# EAGLE design Truss-Power-V4 (EAGLE 8.4.3)

## Sheet 1 of 2
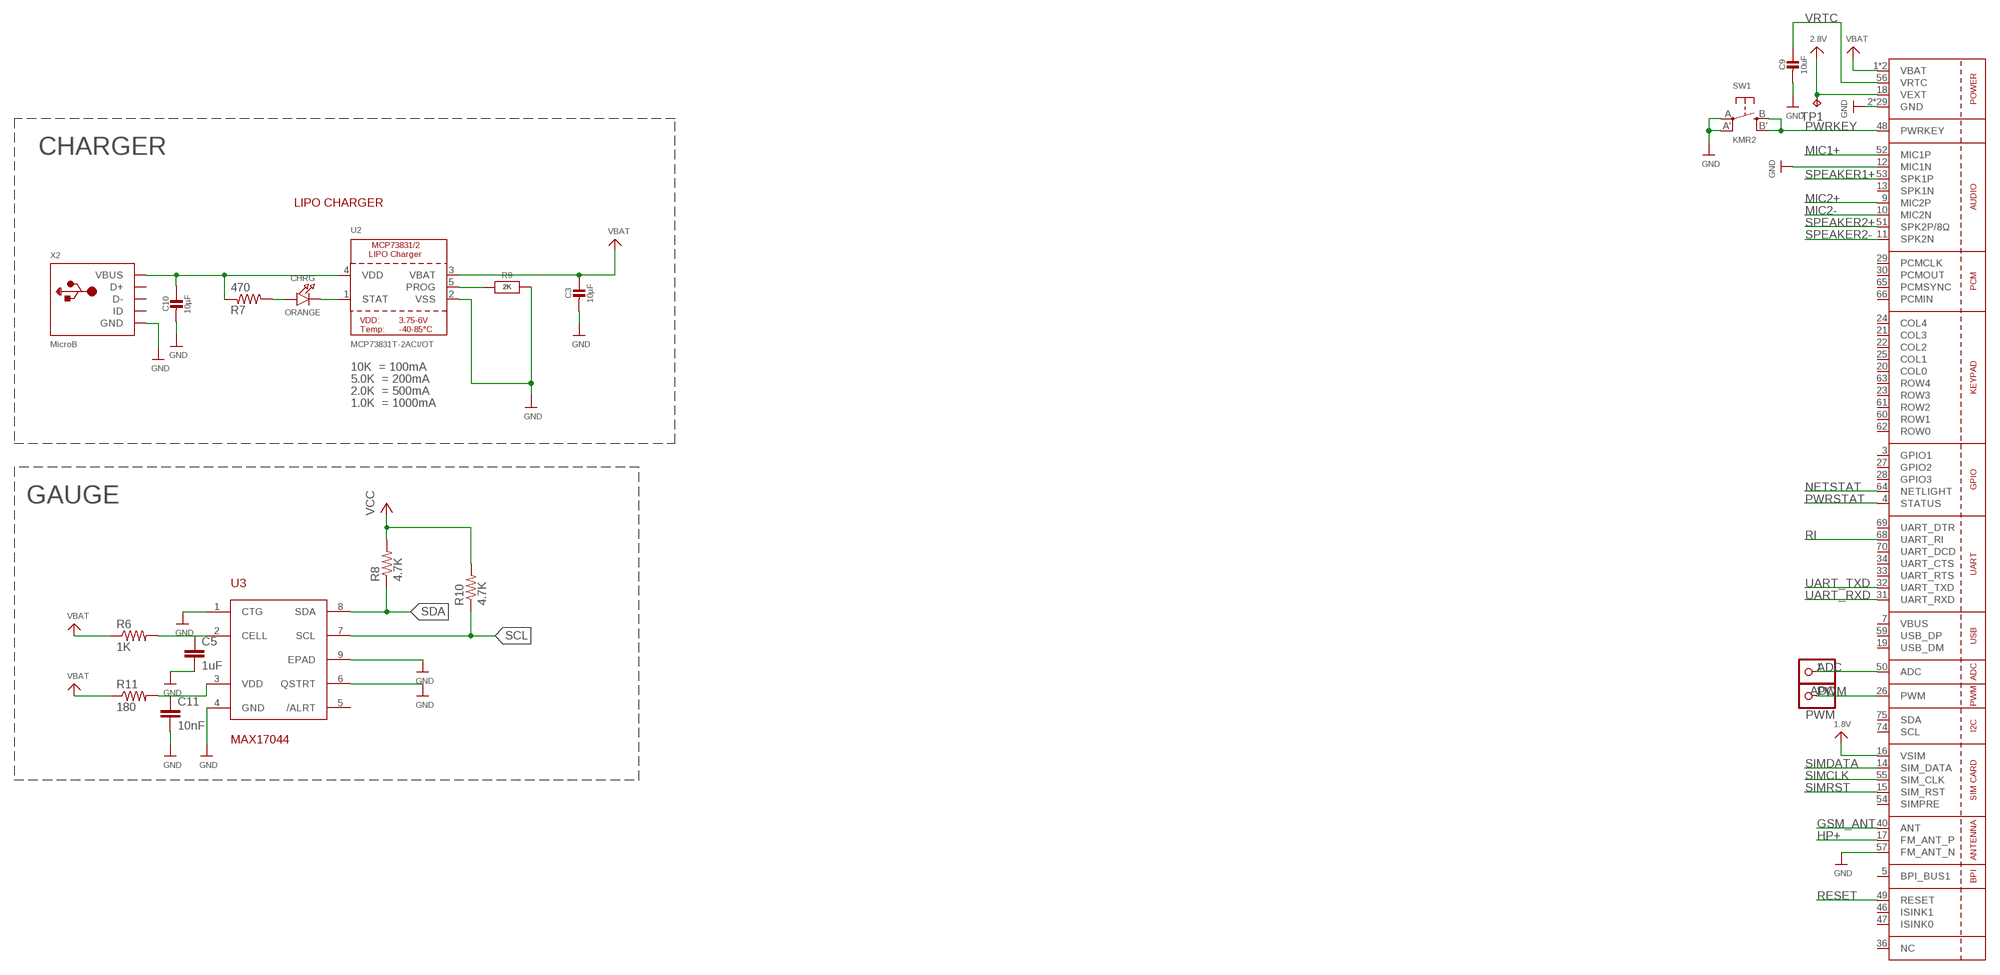
[diagram p0: schematic, sheet 1]

### Parts
ADC  PINHD-1X1CB  [1X01-CLEANBIG]
C3  10µF  CAP_CERAMIC0805-NOOUTLINE  [0805-NO]
C5  1uF  C-EUC0603  [C0603]
C9  10uF  CAP_CERAMIC0805-NOOUTLINE  [0805-NO]
C10  10µF  CAP_CERAMIC0805-NOOUTLINE  [0805-NO]
C11  10nF  C-EUC0603  [C0603]
CHRG  ORANGE  LED0805_NOOUTLINE  [CHIPLED_0805_NOOUTLINE]
PWM  PINHD-1X1CB  [1X01-CLEANBIG]
R6  1K  R-US_R0402  [R0402]
R7  470  R-US_R0402  [R0402]
R8  4.7K  R-US_R0402  [R0402]
R9  2K  RESISTOR0805_NOOUTLINE  [0805-NO]
R10  4.7K  R-US_R0402  [R0402]
R11  180  R-US_R0402  [R0402]
SW1  KMR2  SWITCH_TACT_SMT4.6X2.8  [BTN_KMR2_4.6X2.8]
TP1  TPTP11R  [TP11R]
U2  MCP73831T-2ACI/OT  MCP73831/2  [SOT23-5]
U3  MAX17044  [TDFN]
U4  SIM800H/L  GSM_SIM800L  [SIM800L]
X2  MicroB  USBMICRO_20329  [4UCONN_20329]

### Nets
1.8V: U4.16(VSIM)
2.8V: TP1.TP U4.18(VEXT)
ADC: ADC.1 U4.50(ADC)
GND: C3.2 C5.2 C9.2 C10.2 C11.2 R9.2 SW1.A'(P1) SW1.A(P) U2.2(VSS) U3.1(CTG) U3.4(GND) U3.6(QSTRT) U3.9(EPAD) U4.2(GND) U4.6(GND) U4.8(GND) U4.12(MIC1N) U4.35(GND) U4.37(GND) U4.38(GND) U4.39(GND) U4.41(GND) U4.43(GND) U4.44(GND) U4.45(GND) U4.57(FM_ANT_N) U4.58(GND) U4.67(GND) U4.71(GND) U4.72(GND) U4.73(GND) U4.76(GND) U4.77(GND) U4.78(GND) U4.79(GND) U4.80(GND) U4.81(GND) U4.82(GND) U4.83(GND) U4.84(GND) U4.85(GND) U4.86(GND) U4.87(GND) U4.88(GND) X2.BASE@1(GND) X2.BASE@2(GND) X2.GND X2.SPRT@1(GND) X2.SPRT@2(GND) X2.SPRT@3(GND) X2.SPRT@4(GND) ; also sheet 2
GSM_ANT: U4.40(ANT)
HP+: U4.17(FM_ANT_P)
MIC1+: U4.52(MIC1P)
MIC2+: U4.9(MIC2P)
MIC2-: U4.10(MIC2N)
N$1: C5.1 R6.2 U3.2(CELL)
N$3: C11.1 R11.2 U3.3(VDD)
N$6: CHRG.A R7.2
N$7: CHRG.C U2.1(STAT)
N$14: R9.1 U2.5(PROG)
NETSTAT: U4.64(NETLIGHT)
PWM: PWM.1 U4.26(PWM)
PWRKEY: SW1.B'(S1) SW1.B(S) U4.48(PWRKEY)
PWRSTAT: U4.4(STATUS)
RESET: U4.49(RESET)
RI: U4.68(UART_RI)
SCL: R10.1 U3.7(SCL) ; also sheet 2
SDA: R8.1 U3.8(SDA) ; also sheet 2
SIMCLK: U4.55(SIM_CLK)
SIMDATA: U4.14(SIM_DATA)
SIMRST: U4.15(SIM_RST)
SPEAKER1+: U4.53(SPK1P)
SPEAKER2+: U4.51(SPK2P/8Ω)
SPEAKER2-: U4.11(SPK2N)
UART_RXD: U4.31(UART_RXD)
UART_TXD: U4.32(UART_TXD)
VBAT: C3.1 R6.1 R8.2 R10.2 R11.1 U2.3(VBAT) U4.1(VBAT) U4.42(VBAT) ; supply symbol labelled VCC ; also sheet 2
VBUS: C10.1 R7.1 U2.4(VDD) X2.VBUS
VRTC: C9.1 U4.56(VRTC)
Unconnected: U3.5(/ALRT) U4.3(GPIO1) U4.5(BPI_BUS1) U4.13(SPK1N) U4.19(USB_DM) U4.20(COL0) U4.21(COL3) U4.22(COL2) U4.23(ROW3) U4.24(COL4) U4.25(COL1) U4.27(GPIO2) U4.28(GPIO3) U4.29(PCMCLK) U4.30(PCMOUT) U4.33(UART_RTS) U4.34(UART_CTS) U4.36(NC) U4.46(ISINK1) U4.47(ISINK0) U4.54(SIMPRE) U4.59(USB_DP) U4.60(ROW1) U4.61(ROW2) U4.62(ROW0) U4.63(ROW4) U4.65(PCMSYNC) U4.66(PCMIN) U4.69(UART_DTR) U4.70(UART_DCD) U4.74(SCL) U4.75(SDA) X2.D+ X2.D- X2.ID

### Notes on the sheet
- CHARGER
- LIPO CHARGER
- 10K  = 100mA
- 5.0K  = 200mA
- 2.0K  = 500mA
- 1.0K  = 1000mA
- GAUGE

## Sheet 2 of 2
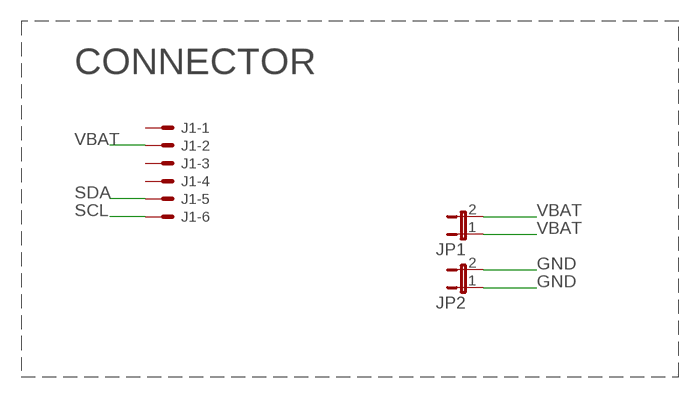
[diagram p1: schematic, sheet 2]

### Parts
J1  XF2L-0625-1  [XF2L-0625-1]
JP1  JP1E  [JP1]
JP2  JP1E  [JP1]

### Nets
GND: JP2.1 JP2.2 ; also sheet 1
SCL: J1.6 ; also sheet 1
SDA: J1.5 ; also sheet 1
VBAT: J1.2 JP1.1 JP1.2 ; also sheet 1
Unconnected: J1.1 J1.3 J1.4

### Notes on the sheet
- CONNECTOR

## Power pins joined to a net without a drawn wire
VBUS: U4.7(VBUS)

## Library data of the parts
ADC PWM = adafruit:PINHD-1X1: Pin header 1x1 for 0.1" spacing With round pins
C3 C9 C10 = microbuilder:CAP_CERAMIC: Ceramic Capacitors For new designs, use the packages preceded by an '_' character since they are more reliable: The following footprints should be used on most boards: _0402 - Standard footprint for regular board layouts _0603 - Standard footprint for regular board layouts _0805 - Standard footprint for regular board layouts _1206 - Standard footprint for regular board layouts For extremely tight-pitch boards where space is at a premium, the following 'micro-pitch' footprints can be used (smaller pads, no silkscreen outline, etc.): _0402MP - Micro-pitch footprint for very dense/compact boards _0603MP - Micro-pitch footprint for very dense/compact boards _0805MP - Micro-pitch footprint for very dense/compact boards _1206MP - Micro-pitch footprint for very dense/compact boards
C5 C11 = rcl:C-EU: CAPACITOR, European symbol
CHRG = microbuilder:LED: LED 0603 - 0603 Surface Mount Package 2mA: Green LED - Low Power (3.9mcd, 2ma, 1.7Vf) - Digikey: 475-2709-2-ND Orange LED - Low Power (9.8mcd, 2ma, 1.8Vf) - Digikey: 475-1194-2-ND Red LED - Low Power (5mcd, 2ma, 1.8Vf) - Digikey: 475-1195-2-ND Yellow LED - Low Power (7mcd, 2ma, 1.8Vf) - Digikey: 475-1196-2-ND 5mA: Blue LED - Low Power (17mcd, 5ma, 2.9Vf) - Digikey: LNJ937W8CRACT-ND 0805 - 0805 Surface Mount Package 2mA: Red LED (8.8mcd, 2mA, 1.8Vf, Clear) - Low Power [Digikey: 475-2510-1-ND] Green LED (5mcd, 2mA, 1.8Vf, Clear) - Low Power [Digikey: 475-2730-1-ND] Yellow LED (11.3mcd, 2mA, 1.8Vf, Clear) - Low Power [Digikey: 475-2555-1-ND] 20mA: Red LED (104mcd, 20mA, Diffused) - LS R976 [Digikey: 475-1278-6-ND] Red LED (12mcd, 20mA, 2.0Vf, Clear) - APT2012EC [Digikey: 754-1128-1-ND] Green LED (15mcd, 20mA, 2.2Vf, Clear) - APT2012GC [Digikey: 754-1131-1-ND] Orange LED (160mcd, 20mA, 2.1Vf, Clear) - APT2012SECK [Digikey: 754-1130-1-ND] 1206 - 1206 Surface Mount Package Green LED (26mcd, 20mA, Diffused) - LG N971 [Digikey: 475-1407-6-ND] Red LED (15mcd, 20mA, Diffused) - LH N974 [Digikey: 475-1416-6-ND] Cree - Cree High-Power Surface Mount LEDs XPEBWT-L1-0000-00D50 - White 111lm 350mA 2.9Vf 6200K 110° XTEAWT-00-0000-00000LEE3 - White 114lm 350mA 2.85Vf 5000K 115° Everlight - Everlight 45-21 Series Surface Mount LEDs 45-21/QK2C-B2832AC2CB2/2T - Warm White 2000mcd 20mA 3.25Vf 3050K 120° 45-21/LK2C-B38452C4CB2/2T - Nuetral White 2000mcd 20mA 3.25Vf 4150K 120° 45-21/LK2C-B50634C6CB2/2T - Cold White 2200mcd 20mA 3.25Vf 5650K 120° PLCC2 Reverse Mount LS T77K-J1L2-1-0-2-R18-Z - Red 11.25mcd 2mA 1.8Vf 630nm 120° LO T77K-L1M2-24-Z - Orange 19.6mcd 2mA 1.8Vf 606nm 120° LY T77K-K2M1-26-Z - Yellow 15.7mcd 2mA 1.8Vf 587nm 120°
J1 = con-omron:XF2*-06?: OMRON FPC Connector Source : http://www.omron.com/ecb/products/pdf/fpc.pdf; MF: OMRON COMPONENTS USA; MPN: XF2L-0625-1; OC_FARNELL: 1536105; OC_NEWARK: 29C7842
JP1 JP2 = jumper:JP1E: JUMPER
R6-R8 R10 R11 = resistor:R-US_: RESISTOR, American symbol
R9 = microbuilder:RESISTOR: Resistors For new designs, use the packages preceded by an '_' character since they are more reliable: The following footprints should be used on most boards: _0402 - Standard footprint for regular board layouts _0603 - Standard footprint for regular board layouts _0805 - Standard footprint for regular board layouts _1206 - Standard footprint for regular board layouts For extremely tight-pitch boards where space is at a premium, the following 'micro-pitch' footprints can be used (smaller pads, no silkscreen outline, etc.): _0402MP - Micro-pitch footprint for very dense/compact boards _0603MP - Micro-pitch footprint for very dense/compact boards _0805MP - Micro-pitch footprint for very dense/compact boards _1206MP - Micro-pitch footprint for very dense/compact boards
SW1 = microbuilder:SWITCH_TACT_SMT: SMT Tact Switches 6x6mm - Digikey: P12940SCT-ND KMR2 (4.6x2.8mm) - Digikey: 401-1426-1-ND EVQ-PQHB55 - Light Touch, 160GF (4.5x4.5mm) - Digikey: P8090SCT-ND KMT0 - KMT021 NGJ LHS (etc.) IP68/Waterproof - Digikey: CKN10289CT-ND
TP1 = testpad:TP: Test pad
U2 = microbuilder:MCP73831/2: MCP73831/2 LIPO Charger VDD: 3.75 - 6V Temp -40 - 85°C Programmable Charge Rate: 15-500mA NOTE: STAT is a tri-state logic output on the MCP73831 and an open-drain output on the MCP73832. SOT23-5 with 4.2V output and tri-state logic on STAT = MCP73831T-2ACI/OT
U3 = NewPart:MAX17044
U4 = microbuilder:GSM_SIM800L: SIM800K Quad-Band GSM/GPRS Module 850/900/1800/1900 MHz Bluetooth EDR (3.0) FM Band: 76-109MHz (50kHz steps) -40 - 85°C
X2 = microbuilder:USB: USB Connectors USBMINIB - Surface Mount Female Mini-B USB Connector 4UConnector: 06564

## Board
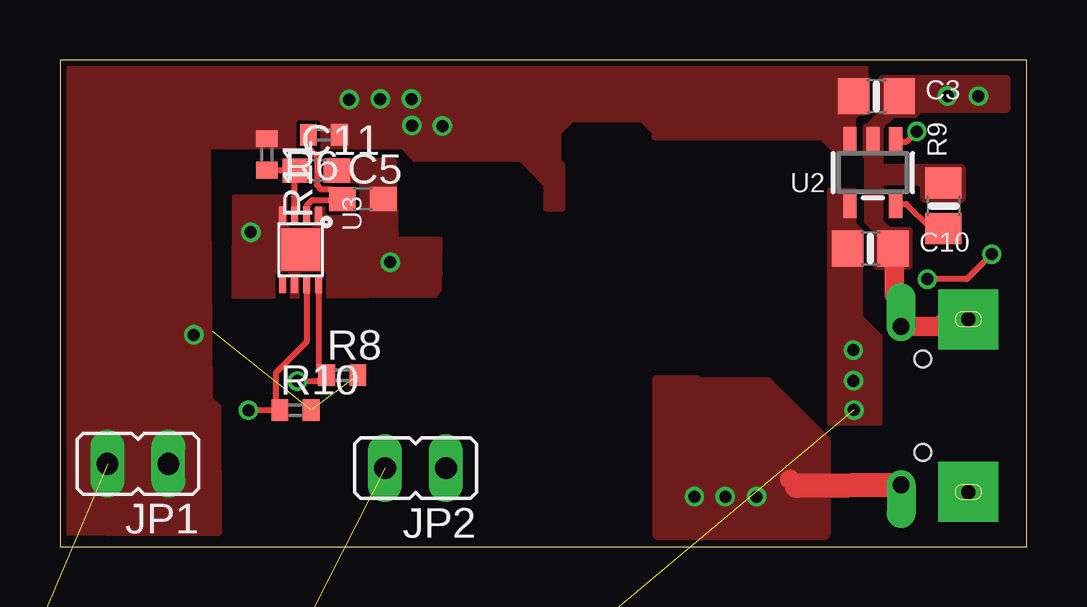
[diagram p2: board, top side]
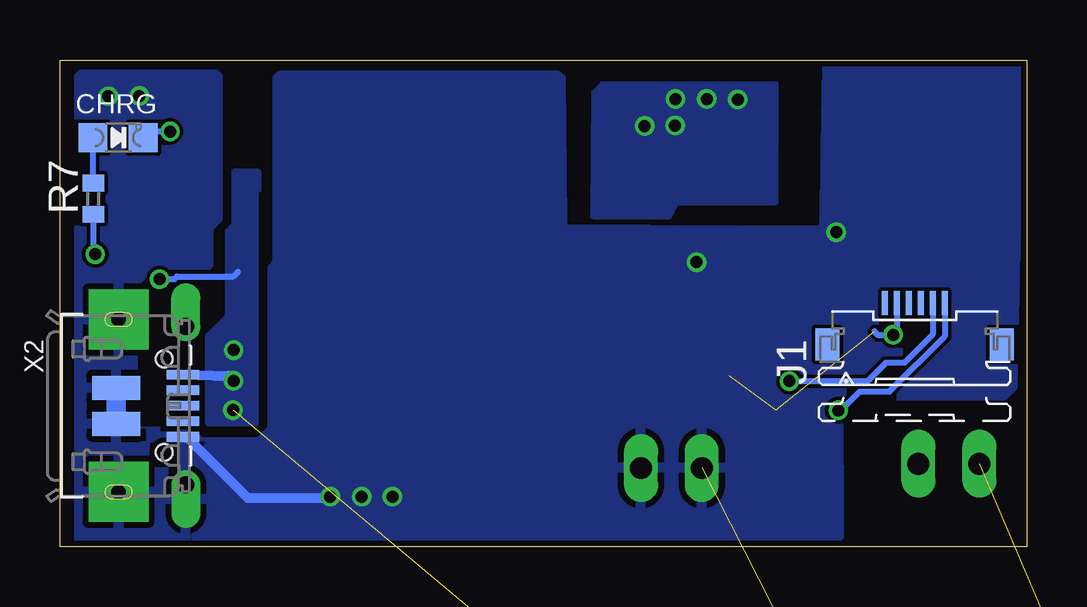
[diagram p3: board, bottom side, seen from below]

Size 40.31 x 20.31 mm. Coordinates in mm from the lower left corner, seen from the top.
Outline: 0,0 40.31,0 40.31,20.31 0,20.31 0,0
Copper layers (1*16): Top 0.035mm / dielectric 1.5mm / Bottom 0.035mm
Design rules "SeeedStudio_2layer_DRU_no_angle_20140221": minimum track width 6mil, minimum drill 12mil, track to track 6mil, track to pad 6mil, pad to pad 6mil, via to via 6mil, smd to smd 0mil, copper to edge 10mil, drill to drill 10mil, minimum pad ring 10mil, minimum via ring 6mil, stop-mask expansion 2mil, vias tented up to drill 100mil, thermal gap 10mil

### Footprints (pad centres in the part's own frame; a part is rotated, then mirrored left to right if it is on the bottom)
1X01-CLEANBIG = drill 1.016 pad 1.778: 1 0,0
0805-NO = smd 1.3 x 1.5: 1 -0.95,0; 2 0.95,0
C0603 = smd 1.1 x 1: 1 -0.85,0; 2 0.85,0
CHIPLED_0805_NOOUTLINE = smd 1.2 x 1.2: A 0,-1.05; C 0,1.05
XF2L-0625-1 = smd 1 x 0.25: 1 1.905,1.25; 2 1.905,0.75; 3 1.905,0.25; 4 1.905,-0.25; 5 1.905,-0.75; 6 1.905,-1.25 | smd 1.34 x 1: M1 0.18,3.638; M2 0.18,-3.638
JP1 = drill 0.914 long: 1 0,-1.27; 2 0,1.27
R0402 = smd 0.7 x 0.9: 1 -0.65,0; 2 0.65,0
BTN_KMR2_4.6X2.8 = smd 0.9 x 1: A 2.05,0.8; A' -2.05,0.8; B 2.05,-0.8; B' -2.05,-0.8
TP11R = smd 1.1 x 1.1: TP 0,0
SOT23-5 = smd 0.55 x 1.2: 1 -0.95,-1.3; 2 0,-1.3; 3 0.95,-1.3; 4 0.95,1.3; 5 -0.95,1.3
TDFN = smd 0.3 x 0.7: 1 -0.75,-1.45; 2 -0.25,-1.45; 3 0.25,-1.45; 4 0.75,-1.45; 5 0.75,1.45; 6 0.25,1.45; 7 -0.25,1.45; 8 -0.75,1.45 | smd 1.63 x 1.75: 9 0,0
SIM800L = smd 1.1 x 0.9: 1 -8.1,5.6; 2 -8.1,4.2; 3 -8.1,2.8; 4 -8.1,1.4; 5 -8.1,0; 6 -8.1,-1.4; 7 -8.1,-2.8; 8 -8.1,-4.2; 9 -8.1,-5.6; 22 8.1,-5.6; 23 8.1,-4.2; 24 8.1,-2.8; 25 8.1,-1.4; 26 8.1,0; 27 8.1,1.4; 28 8.1,2.8; 29 8.1,4.2; 30 8.1,5.6; 43 -6.36,5.6; 44 -6.36,4.2; 45 -6.36,2.8; 46 -6.36,1.4; 47 -6.36,0; 48 -6.36,-1.4; 49 -6.36,-2.8; 50 -6.36,-4.2; 51 -6.36,-5.6; 60 6.36,-5.6; 61 6.36,-4.2; 62 6.36,-2.8; 63 6.36,-1.4; 64 6.36,0; 65 6.36,1.4; 66 6.36,2.8; 67 6.36,4.2; 68 6.36,5.6 | smd 0.9 x 1.1: 10 -7.7,-7.1; 11 -6.3,-7.1; 12 -4.9,-7.1; 13 -3.5,-7.1; 14 -2.1,-7.1; 15 -0.7,-7.1; 16 0.7,-7.1; 17 2.1,-7.1; 18 3.5,-7.1; 19 4.9,-7.1; 20 6.3,-7.1; 21 7.7,-7.1; 31 7.7,7.1; 32 6.3,7.1; 33 4.9,7.1; 34 3.5,7.1; 35 2.1,7.1; 36 0.7,7.1; 37 -0.7,7.1; 38 -2.1,7.1; 39 -3.5,7.1; 40 -4.9,7.1; 41 -6.3,7.1; 42 -7.7,7.1; 52 -4.9,-5.5; 53 -3.5,-5.5; 54 -2.1,-5.5; 55 -0.7,-5.5; 56 0.7,-5.5; 57 2.1,-5.5; 58 3.5,-5.5; 59 4.9,-5.5; 69 4.9,5.5; 70 3.5,5.5; 71 2.1,5.5; 72 0.7,5.5; 73 -0.7,5.5; 74 -2.1,5.5; 75 -3.5,5.5; 76 -4.9,5.5 | smd 1.5 x 1.5: 77 -3.9,3 | smd 2.3 x 2.7: 78 -3.9,0; 79 -3.9,-3; 80 -1.3,-3; 81 1.3,-3; 82 3.9,-3; 83 3.9,0; 84 3.9,3; 85 1.3,3; 86 -1.3,3; 87 -1.3,0; 88 1.3,0
4UCONN_20329 = smd 1 x 2: BASE@1 -0.75,-2; BASE@2 0.75,-2 | smd 0.4 x 1.35: D+ 0,0.775; D- -0.65,0.775; GND 1.3,0.775; ID 0.65,0.775; VBUS -1.3,0.775 | drill 0.7 offset: SPRT@1 -3.3,0.9; SPRT@2 3.3,0.9 | drill 0.6 pad 2.5 square: SPRT@3 -3.6,-1.9; SPRT@4 3.6,-1.9 | hole 0.7: -1.95,0; 1.95,0

### Placement (x,y rotation side)
ADC  -1.04,-43.71 0 top  (outside the outline)
C3  34.04,18.8 0 top
C5  12.62,14.5 0 top
C9  14.62,-55.1 0 top  (outside the outline)
C10  33.78,12.45 0 top
C11  10.69,15.7 0 top
CHRG  37.89,17.07 270 bottom
J1  4.68,8.26 90 bottom
JP1  3.25,3.47 90 top
JP2  14.82,3.29 90 top
PWM  -1.04,-61.49 0 top  (outside the outline)
R6  11.01,17.19 180 top
R7  38.92,14.52 90 bottom
R8  11.77,7.16 0 top
R9  36.83,14.22 90 top
R10  9.82,5.71 0 top
R11  8.63,16.37 270 top
SW1  10.41,-55.55 0 top  (outside the outline)
TP1  -8.1,-72.81 0 top  (outside the outline)
U2  33.88,15.61 180 top
U3  10.03,12.4 180 top
U4  0.27,-25.78 0 top  (outside the outline)
X2  35.97,5.89 270 bottom

### Tracks (layer width: path | path; a pad name or v marks a point on that pad's centre or on a via)
2.8V  (1 unrouted)
ADC  (1 unrouted)
GND  (via drill 0.5)  (34 unrouted)
  Top 0.813: C10.2 34.79,12.39 34.79,10.51 35.07,10.23 X2.SPRT@1 36.66,9.19 36.95,9.49 X2.SPRT@3 | 30.72,2.54 30.43,2.83
  Top 1.016: X2.SPRT@2 30.72,2.54
  Bottom 0.406: X2.GND 34.98,4.54 32.48,2.04 29.1,2.04 v29.04,2.1
  Bottom 0.813: X2.BASE@1 X2.BASE@2
  other vias: 37,18.81 38.29,18.8 13.77,11.87 7.96,13.12 26.45,2.1 27.73,2.1
  pour Top (no thermals): 34.33,19.57 39.46,19.57 39.48,19.55 39.48,18.25 39.45,18.22 35.85,18.22 35.64,18.01 34.71,18.01 34.19,17.49 34.19,15.9 34.23,15.86 37.58,15.86 37.63,15.81 37.63,14.51 37.59,14.47 36.04,14.47 35.99,14.52 35.99,15 35.8,15.19 34.21,15.19 34.19,15.17 34.19,13.58 34.54,13.23 35.38,13.23 35.41,13.2 35.41,11.71 35.37,11.67 34.05,11.67 34.04,11.68 34.04,13.16 33.65,13.55 33.65,16.23 33.59,16.29 33.59,17.51 33.61,17.53 33.67,17.53 34.19,18.05 34.19,19.47 34.29,19.57
  pour Top (no thermals): 24.85,7.04 26.56,7.04 26.63,6.97 29.51,6.97 32.01,4.47 32.01,0.53 31.89,0.41 25,0.41 24.9,0.41 24.82,0.49 24.82,7.01
  pour Bottom: 8.35,20.04 8.46,13.18 19.35,13.23 19.37,13.6 19.42,19.53 19.54,19.65 31.13,19.65 31.25,19.53 31.25,11.81 31.47,11.59 31.47,4.92 32.02,4.37 34.45,4.37 34.88,4.8 37.25,4.8 37.25,10.97 36.51,11.71 34.17,11.71 34.12,11.76 34.12,13.33 33.71,13.74 33.71,19.6 33.81,19.7 39.42,19.7 39.52,19.6 39.52,0.29 39.37,0.14 8.04,0.24 7.82,0.47 7.84,6.32 3.48,6.33 0.95,6.33 0.59,6.67 0.3,20
  pour Top (no thermals): 7.3,14.6 9.92,14.6 10.58,14.6 10.89,14.6 10.87,16.13 12.02,16.11 12.58,16.13 13.91,16.1 13.99,12.83 15.83,12.83 15.78,10.74 15.62,10.5 7.27,10.45
N$1
  Top 0.254: R6.2 10.36,16.63 10.71,16.27 10.71,15.08 10.87,14.92 11.36,14.92 C5.1 11.74,14.47 10.52,14.47 10.28,14.24 U3.2
N$3
  Top 0.254: U3.3 9.78,15.64 C11.1 9.82,15.72 R11.2
N$6
  Bottom 0.254: CHRG.A 38.94,15.19 R7.2
N$7  (via drill 0.5)
  Top 0.254: U2.1 35.3,16.91 v35.72,17.33
  Bottom 0.254: 36.45,17.13 CHRG.C 36.58,17.33 v35.72,17.33
N$14
  Top 0.254: U2.5 35.27,14.31 36.26,13.32 36.78,13.32 R9.1
PWM  (1 unrouted)
PWRKEY  (2 unrouted)
SCL  (via drill 0.5)
  Top 0.254: U3.7 10.28,8.55 8.99,7.26 8.99,5.87 9.16,5.7 | 9.16,5.7 v7.86,5.7 | 9.16,5.7 R10.1
  Bottom 0.254: J1.6 3.43,8.78 5.73,6.48 6.97,6.48 7.75,5.7 v7.86,5.7
SDA  (via drill 0.5)
  Top 0.254: U3.8 10.78,7.5 11.05,7.22 | 11.05,7.22 R8.1 | v9.9,6.92 10.75,6.92 11.05,7.22
  Bottom 0.254: v9.9,6.92 9.88,6.9 6.67,6.9 6.67,6.89 5.88,7.68 5.11,7.68 3.93,8.86 J1.5
VBAT  (via drill 0.5)  (4 unrouted)
  Top 0.254: R8.2 12.47,7.22
  Bottom 0.254: J1.2 5.43,9 v5.58,8.85 v5.59,8.84 6.21,8.84 6.36,8.99
  other vias: 12.06,18.66 13.35,18.68 14.65,18.68 14.67,17.58 15.94,17.56
  pour Bottom (no thermals): 10.46,19.28 17.7,19.28 18.05,18.93 18.1,13.81 18.01,13.79 14.91,13.79 14.62,14.36 14.59,14.39 12.39,14.38 10.48,14.39
  pour Top (no thermals): 0.13,0.61 3.71,0.57 6.63,0.58 6.62,5.84 6.26,6.18 6.17,16.7 14.27,16.71 14.81,16.17 19.23,16.2 20.26,15.11 20.26,14.12 20.95,14.12 20.95,15.93 20.78,16.1 20.78,17.27 21.35,17.84 24.26,17.84 24.78,17.32 24.78,17.1 31.75,17.1 32.38,16.47 33.08,16.47 33.08,17.9 33.32,18.14 33.6,18.14 33.6,20.17 0.1,20.22 0.16,19.41
VBUS  (via drill 0.5)  (1 unrouted)
  Top 0.254: v38.84,12.21 37.8,11.17 v36.16,11.17
  Bottom 0.254: R7.1 38.92,12.29 v38.84,12.21 | v36.16,11.17 35.55,11.17 35.43,11.28 33.08,11.28 32.89,11.47
  Bottom 0.406: X2.VBUS 33.29,7.14 v33.08,6.93
  other vias: 33.07,8.21 33.1,5.71
  pour Top (no thermals): 32.32,14.87 33.07,14.87 33.07,13.75 33.07,13.45 33.35,13.17 33.35,9.59 34.16,8.78 34.16,5.17 32.11,5.17 32.11,14.87 32.29,14.87
  pour Bottom (no thermals): 32.03,15.64 33.05,15.64 33.05,13.42 33.33,13.14 33.33,9.62 34.15,8.8 34.15,5.17 32.13,5.17 32.13,14.89 32.03,14.89
VRTC  (1 unrouted)